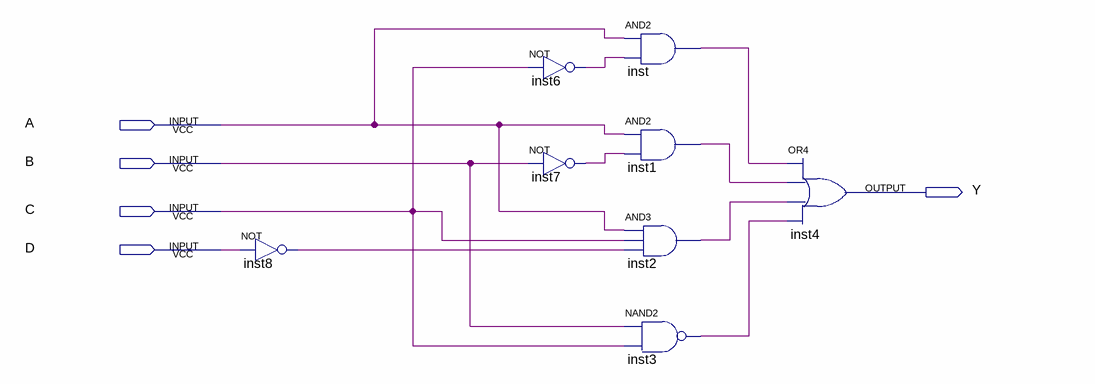
[diagram p0: schematic sheet]
// Quartus schematic balandin_vladislav_1.bdf as structural Verilog: 8 symbols, 5 pins
module balandin_vladislav_1 (
  input  A,
  input  B,
  input  C,
  input  D,
  output Y
);

  wire inst1_out, inst2_out, inst3_out, inst6_out, inst7_out, inst8_out, inst_out;

  not inst8 (inst8_out, D);
  not inst6 (inst6_out, C);
  not inst7 (inst7_out, B);
  and inst (inst_out, A, inst6_out);
  and inst1 (inst1_out, A, inst7_out);
  and inst2 (inst2_out, A, C, inst8_out);
  nand inst3 (inst3_out, B, C);
  or inst4 (Y, inst_out, inst1_out, inst2_out, inst3_out);
endmodule
